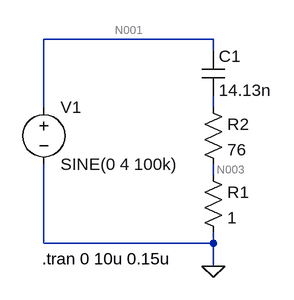
[diagram p0: schematic TP4EJ12.asc]
TP4EJ12.asc, the LTspice schematic file:
Version 4
SHEET 1 880 680
WIRE 288 32 48 32
WIRE 288 48 288 32
WIRE 48 128 48 32
WIRE 288 128 288 112
WIRE 288 224 288 208
WIRE 48 320 48 208
WIRE 288 320 288 304
WIRE 288 320 48 320
WIRE 288 352 288 320
FLAG 288 352 0
SYMBOL voltage 48 112 R0
WINDOW 123 0 0 Left 0
WINDOW 39 0 0 Left 0
SYMATTR InstName V1
SYMATTR Value SINE(0 4 100k)
SYMBOL res 272 208 R0
SYMATTR InstName R1
SYMATTR Value 1
SYMBOL cap 272 48 R0
SYMATTR InstName C1
SYMATTR Value 14.13n
SYMBOL res 272 112 R0
SYMATTR InstName R2
SYMATTR Value 76
TEXT 46 342 Left 2 !.tran 0 10u 0.15u

The netlist it stands for:
* TP4EJ12.asc
V1 N001 0 SINE(0 4 100k)
R1 N003 0 1
C1 N001 N002 14.13n
R2 N002 N003 76
.tran 0 10u 0.15u
.backanno
.end

* Results of the author's LTspice run, read from the files saved beside the schematic
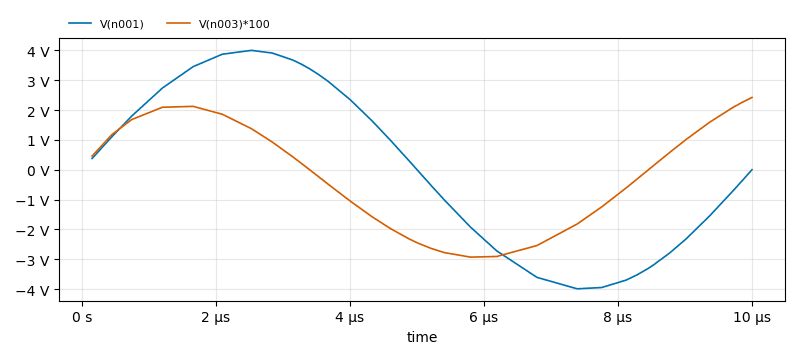
[diagram p1: Transient Analysis of TP4EJ12.asc, plotted from the saved traces]
* Transient Analysis, 1 run:
*   V(n001): min -3.991 V, max 3.999 V, average -442.8 µV, rms 2.844 V, last 0 V
*   V(n003)*100: min -2.929 V, max 2.42 V, average -271.6 mV, rms 1.837 V, last 2.42 V